# EasyEDA Pro project ProPrj_机房综合监控系统设计与实现_2026-04-17.epro

# Schematic Schematic1
Assembly Variant: Basic; Board Name: Board1; Create Date: 2026-04-17; Page Name: P1; Project Name: 机房综合监控系统设计与实现; Schematic Name: Schematic1; Update Date: 2026-04-17; BladeWidth: 10; Company: 嘉立创EDA; Page Size: A4; RegionStart: 1; ShowBorder: 1; TitleBlock: 1; TitleBlockPosition: 3; Version: V1.0; XRegionCount: 6; YRegionCount: 4
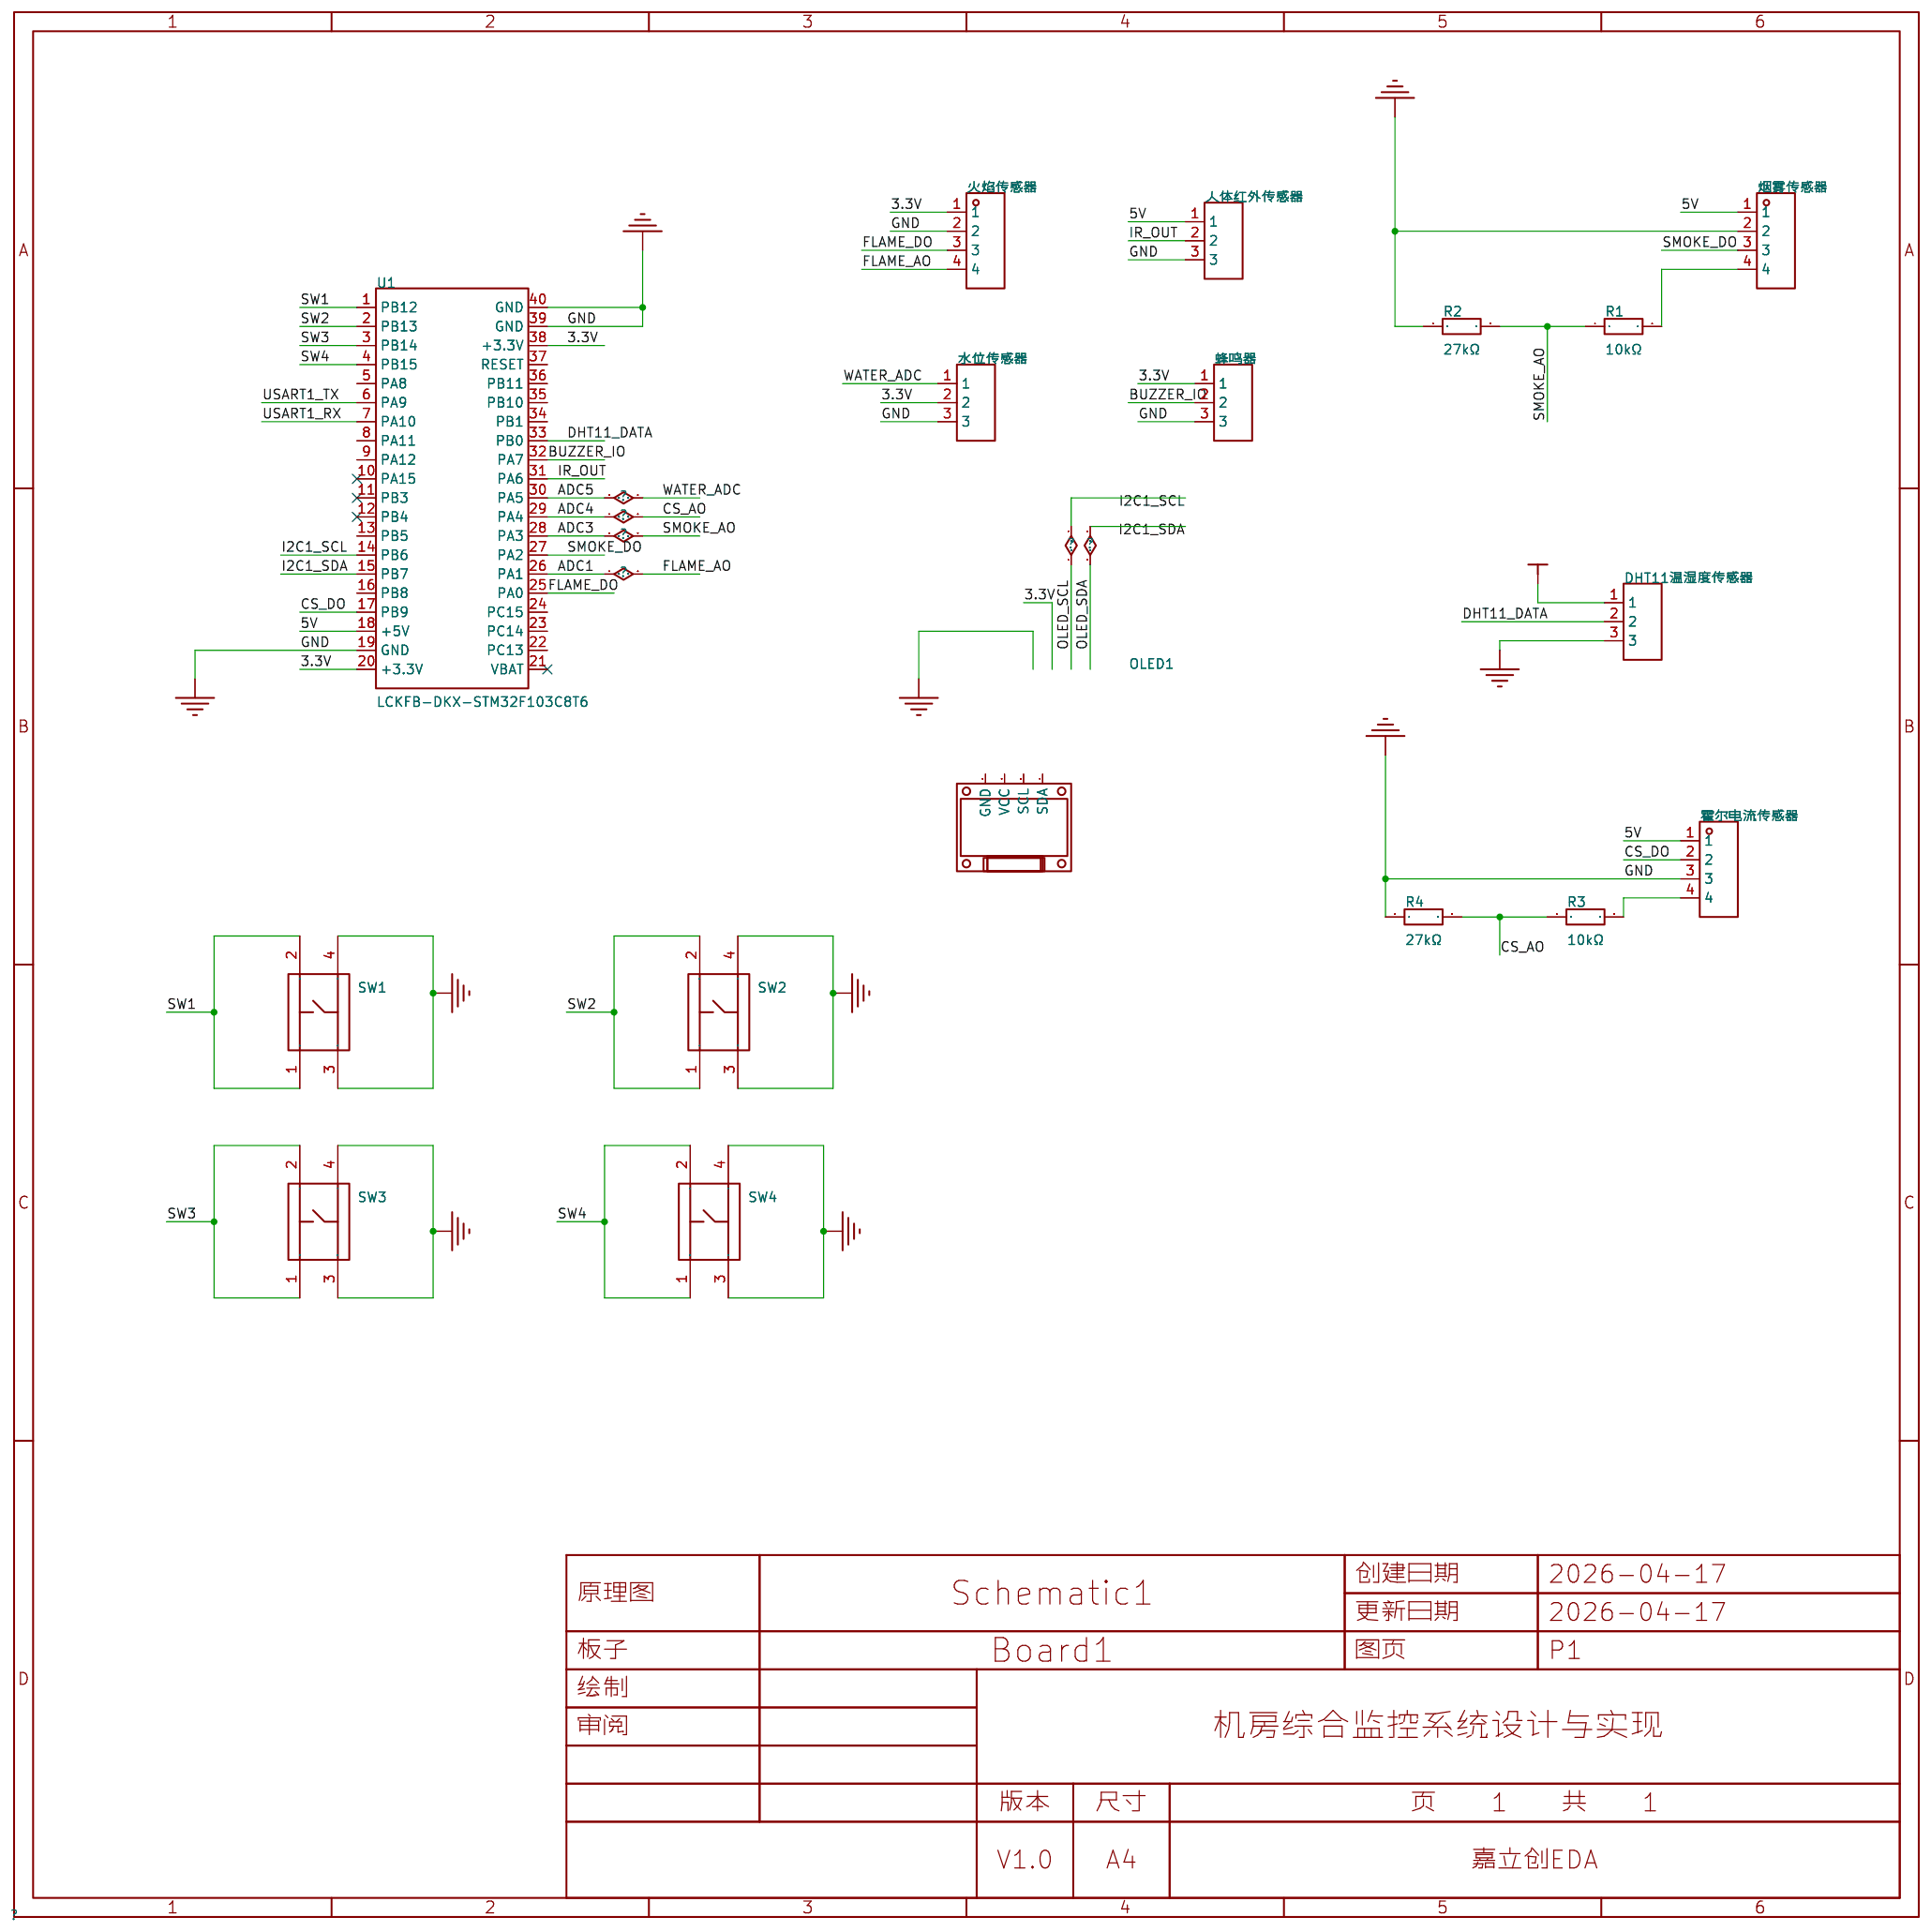
[diagram p0: schematic sheet]

## Parts
DHT11温湿度传感器  -  [HDR-TH_3P-P2.54-V-F]
OLED1  -  [0.96OLED_4P]
R1  10kΩ  [R0805]
R2  27kΩ  [R0805]
R3  10kΩ  [R0805]
R4  27kΩ  [R0805]
SW1  K2-1102DP-C4SW-04  [KEY-TH_4P-L6.0-W6.0-P4.50-LS6.50]
SW2  K2-1102DP-C4SW-04  [KEY-TH_4P-L6.0-W6.0-P4.50-LS6.50]
SW3  K2-1102DP-C4SW-04  [KEY-TH_4P-L6.0-W6.0-P4.50-LS6.50]
SW4  K2-1102DP-C4SW-04  [KEY-TH_4P-L6.0-W6.0-P4.50-LS6.50]
U1  LCKFB-DKX-STM32F103C8T6  [CONN-TH_L53.3-W22.9_STM32F103C8T6-CARD]
人体红外传感器  -  [HDR-TH_3P-P2.54-V-F]
水位传感器  -  [HDR-TH_3P-P2.54-V-F]
火焰传感器  -  [HDR-TH_4P-P2.54-V-F]
烟雾传感器  -  [HDR-TH_4P-P2.54-V-F]
蜂鸣器  -  [HDR-TH_3P-P2.54-V-F]
霍尔电流传感器  -  [HDR-TH_4P-P2.54-V-F]

## Library data of the parts
DHT11温湿度传感器 人体红外传感器 水位传感器 蜂鸣器 = HDR-F_2.54_1x3P: Supplier Part: C541850; Supplier Footprint: 插件
OLED1 = 0.96OLED模块_4P: Supplier Footprint: 插件
R1-R4 = 0805W8F1002T5E_C17414: 电阻类型:厚膜电阻;阻值:10kΩ;精度:±1%;功率:125mW;工作电压:150V;温度系数:±100ppm/℃;; LCSC Part Name: 10kΩ ±1% 125mW 厚膜电阻; Supplier Part: C17414; Manufacturer: UNI-ROYAL(厚声); Manufacturer Part: 0805W8F1002T5E; Supplier Footprint: 0805; JLCPCB Part Class: Basic Part; Datasheet: https://item.szlcsc.com/datasheet/0805W8F1002T5E/18102.html; Supplier: LCSC; Type: 厚膜电阻; Tolerance: ±1%; Power(Watts): 125mW; Voltage-Supply(Max): 150V; Temperature Coefficient: ±100ppm/℃; Operating Temperature: -55℃~+155℃
SW1-SW4 = K2-1102DP-C4SW-04: 电路结构:单刀单掷;按钮形状:圆形按钮;作用力:2.5N;安装方式:直插;开关长度:6mm;开关宽度:6mm;开关高度:5mm;触点电流:50mA;额定电压:12V;带灯:-;工作寿命:10万次;; LCSC Part Name: 轻触按键开关6*6*5; Supplier Part: C110153; Manufacturer: 韩国韩荣; Supplier Footprint: 插件-4P,6x6mm; JLCPCB Part Class: Extended Part; Datasheet: https://item.szlcsc.com/datasheet/K2-1102DP-C4SW-04/111374.html; Supplier: LCSC; Circuit: 单刀单掷; Actuator Style: 圆形按钮; Operating Force: 2.5N; Mounting Type: 直插; Length: 6mm; Width: 6mm; Switch Height: 5mm; Contact Current: 50mA; Voltage Rating: 12V; Life: 10万次; Operating Temperature: -25℃~+85℃
U1 = LCKFB-DKX-STM32F103C8T6: 搭载Contex M3内核,程序存储容量64KB,RAM总容量20KB,最高72MHz主频,提供高效的计算能力和稳定的运行环境。; LCSC Part Name: 立创·地阔星-STM32F103C8T6开发板; Supplier Part: C22396880; Manufacturer: 立创开发板; JLCPCB Part Class: Extended Part; Datasheet: https://item.szlcsc.com/datasheet/LCKFB-DKX-STM32F103C8T6/24005615.html; Supplier: LCSC
火焰传感器 烟雾传感器 霍尔电流传感器 = HDR-F_2.54_1x4P: Supplier Part: C2718488; Supplier Footprint: 插件

## Nets
3.3V: DHT11温湿度传感器.1 U1.20(+3.3V) U1.38(+3.3V) 水位传感器.2 火焰传感器.1 蜂鸣器.1
5V: U1.18(+5V) 人体红外传感器.1 烟雾传感器.1 霍尔电流传感器.1
GND: DHT11温湿度传感器.3 R2.1 R4.1 SW1.3 SW1.4 SW2.3 SW2.4 SW3.3 SW3.4 SW4.3 SW4.4 U1.19(GND) U1.39(GND) U1.40(GND) 人体红外传感器.3 水位传感器.3 火焰传感器.2 烟雾传感器.2 蜂鸣器.3 霍尔电流传感器.3
ADC1: U1.26(PA1) 火焰传感器.4
ADC3: R1.1 R2.2 U1.28(PA3)
ADC4: R3.1 R4.2 U1.29(PA4)
ADC5: U1.30(PA5) 水位传感器.1
BUZZER_IO: U1.32(PA7) 蜂鸣器.2
CS_DO: U1.17(PB9) 霍尔电流传感器.2
DHT11_DATA: DHT11温湿度传感器.2 U1.33(PB0)
FLAME_DO: U1.25(PA0) 火焰传感器.3
I2C1_SCL: U1.14(PB6)
I2C1_SDA: U1.15(PB7)
IR_OUT: U1.31(PA6) 人体红外传感器.2
SMOKE_DO: U1.27(PA2) 烟雾传感器.3
SW1: SW1.1 SW1.2 U1.1(PB12)
SW2: SW2.1 SW2.2 U1.2(PB13)
SW3: SW3.1 SW3.2 U1.3(PB14)
SW4: SW4.1 SW4.2 U1.4(PB15)
USART1_RX: U1.7(PA10)
USART1_TX: U1.6(PA9)
$1N28: R1.2 烟雾传感器.4
$1N67: R3.2 霍尔电流传感器.4

Not connected (* = marked no-connect by the designer): OLED1 1(GND) 2(VCC) 3(SCL) 4(SDA); U1 5(PA8) 8(PA11) 9(PA12) 10(PA15)* 11(PB3)* 12(PB4)* 13(PB5) 16(PB8) 21(VBAT)* 22(PC13) 23(PC14) 24(PC15) 34(PB1) 35(PB10) 36(PB11) 37(RESET)

# Board PCB1
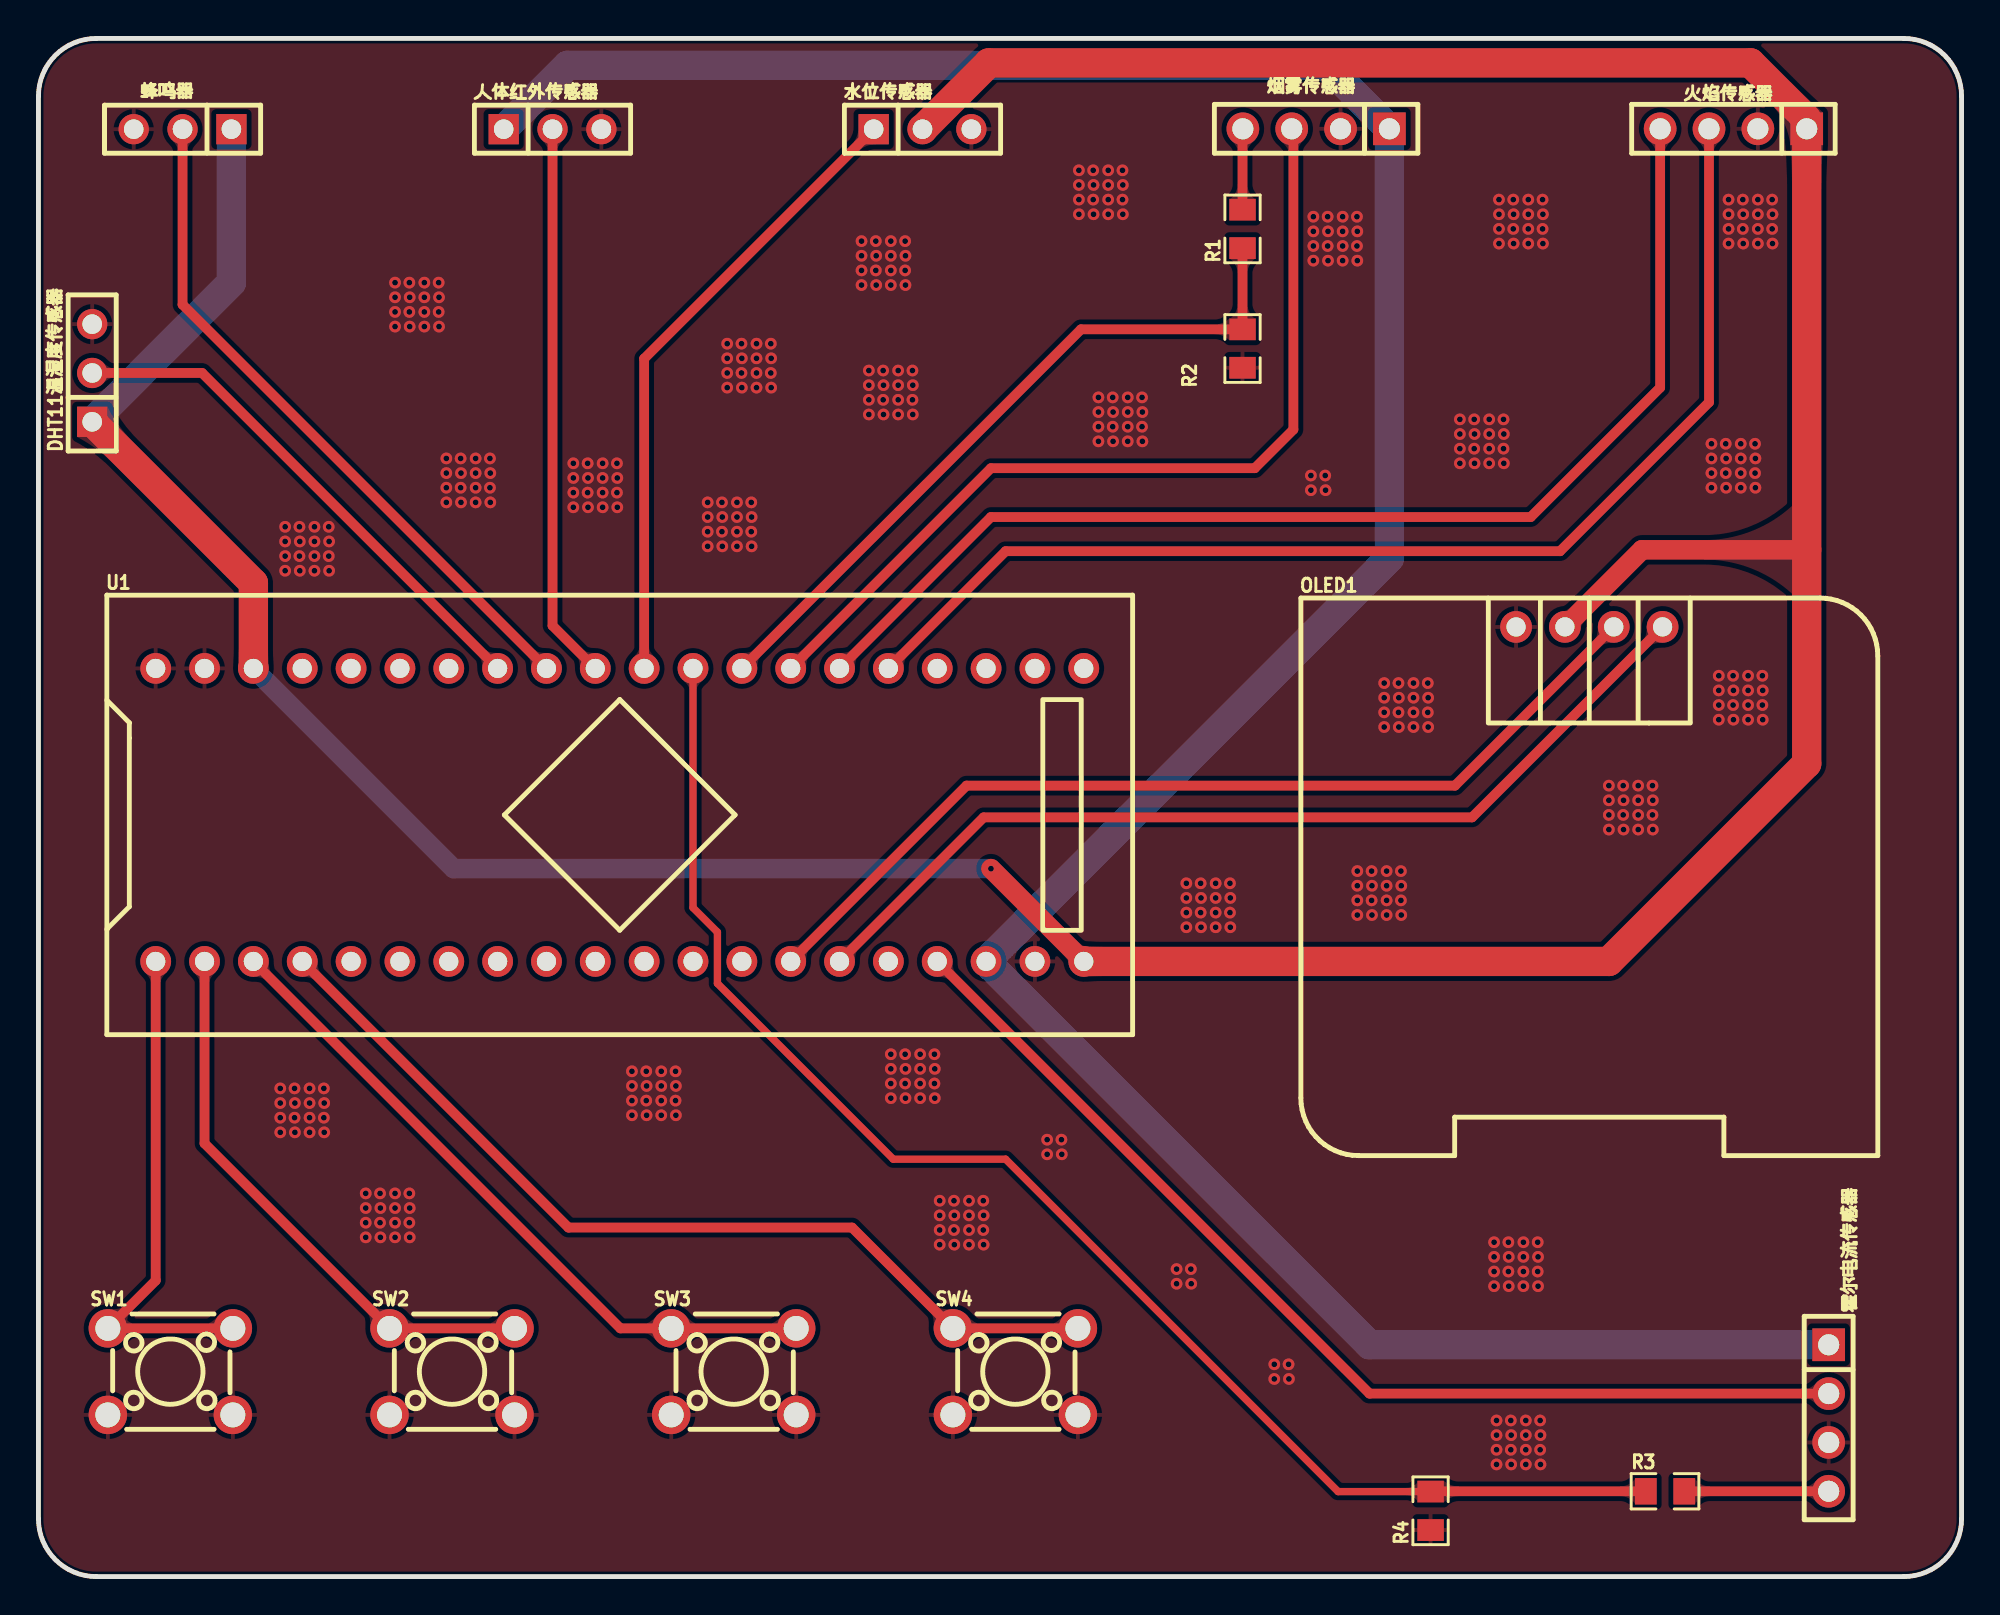
[diagram p1: board, top side]
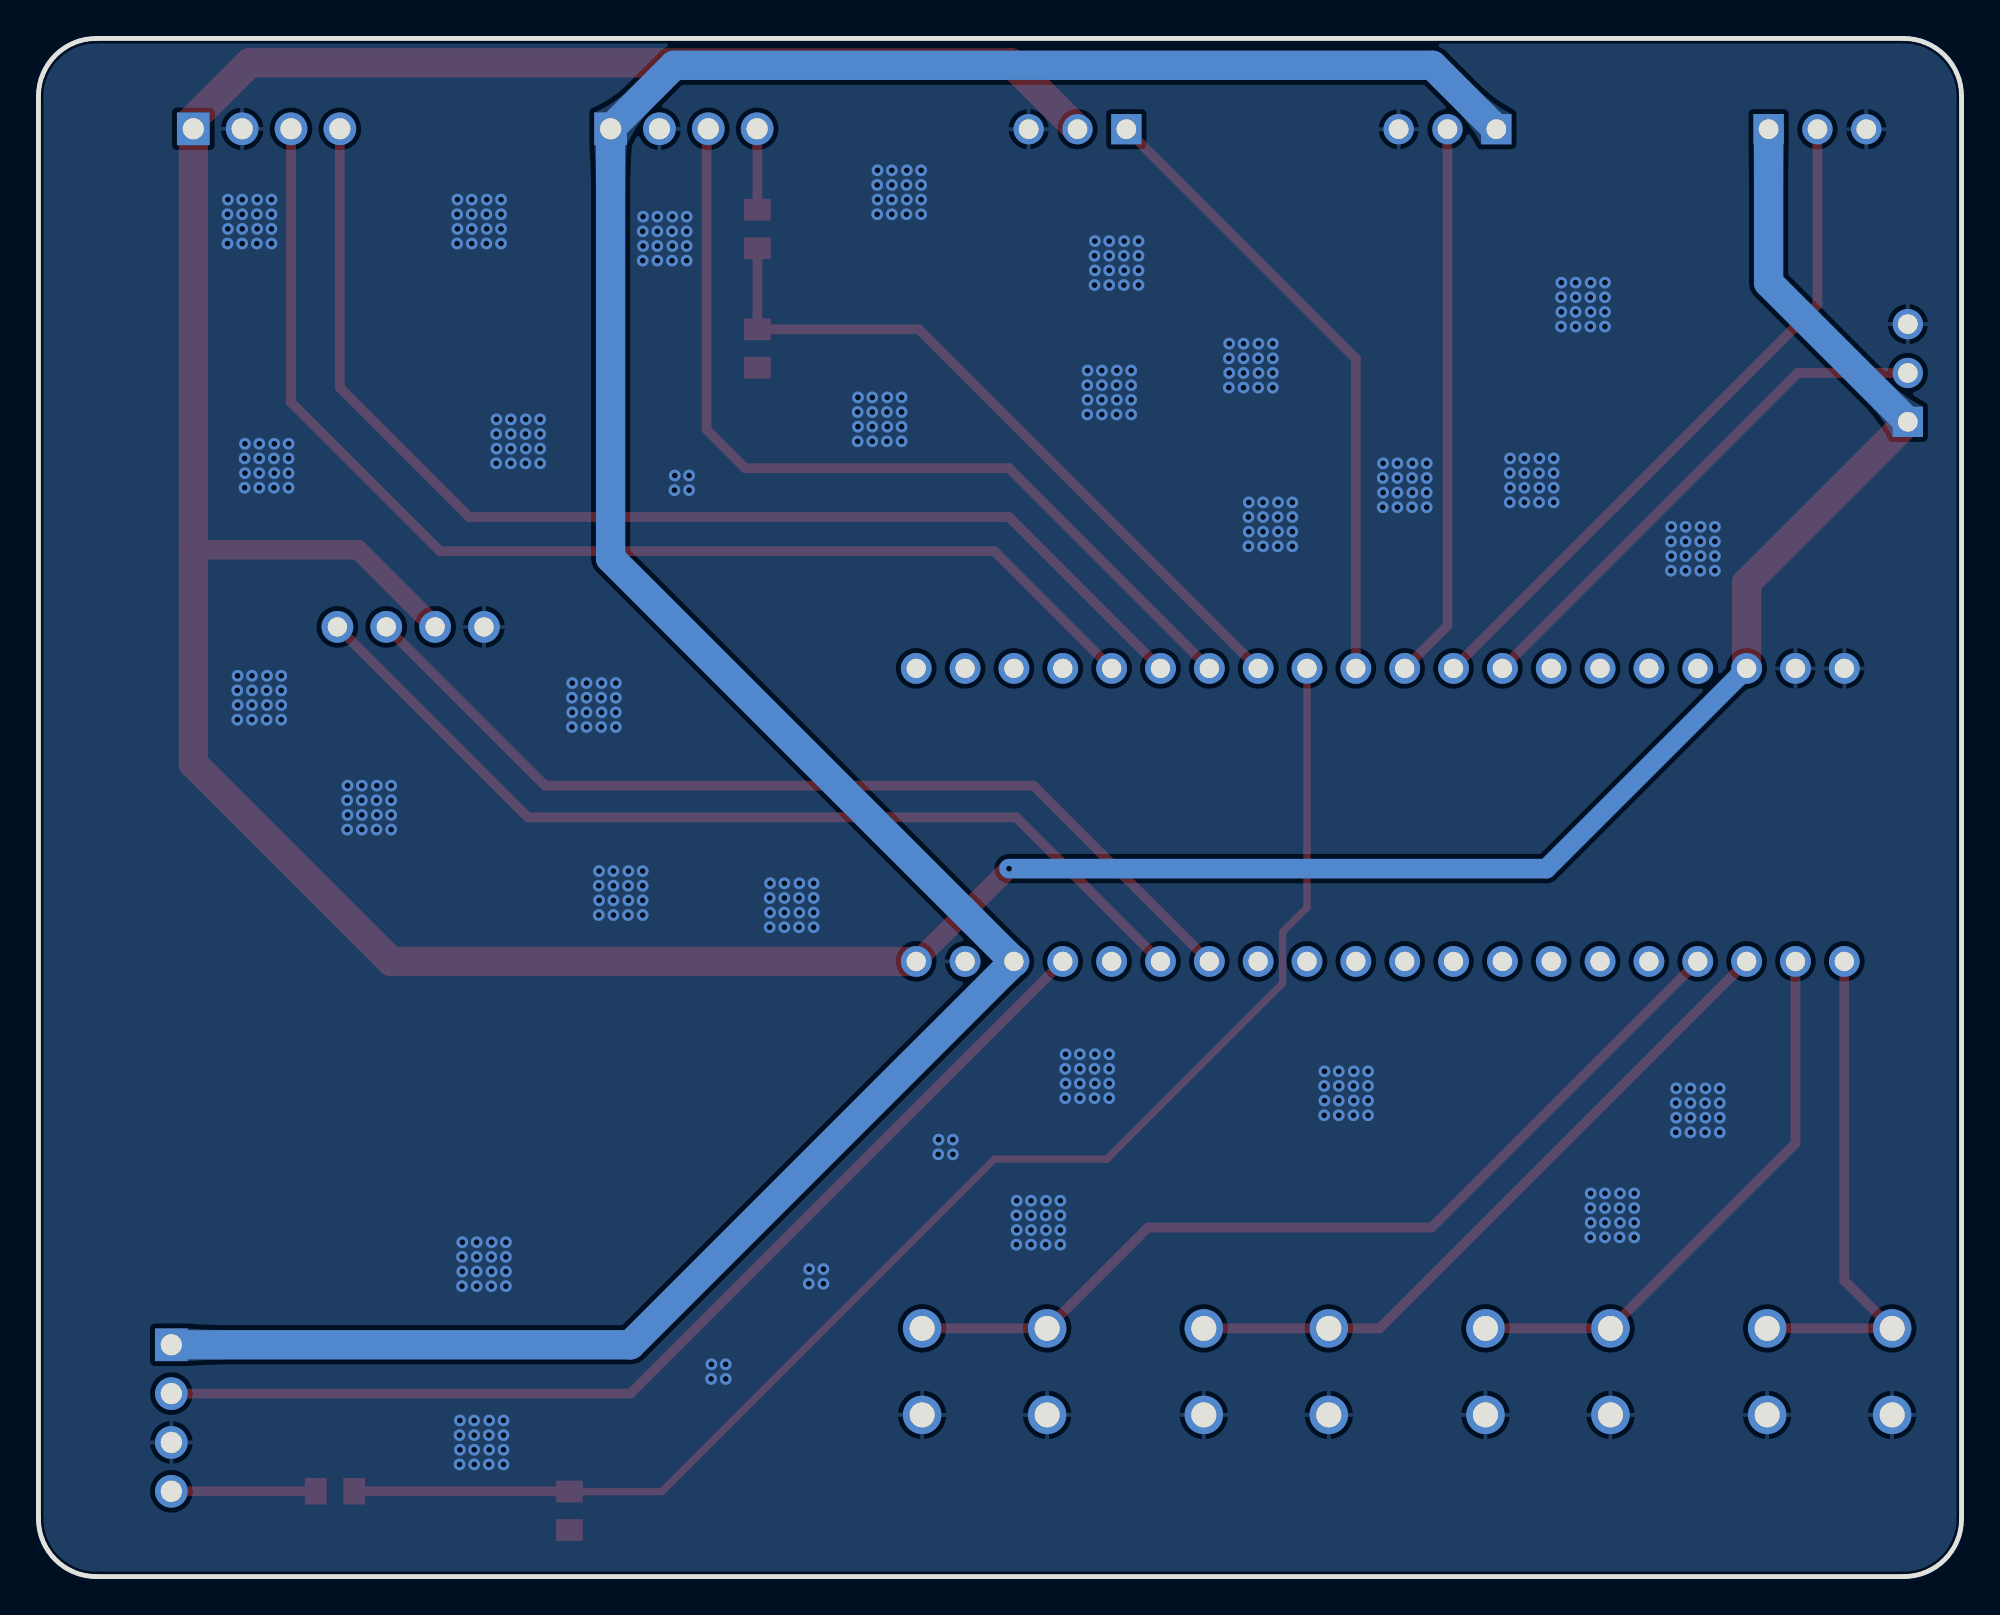
[diagram p2: board, bottom side, seen from below]

Outline 100 x 80 mm; copper layers: Top Layer, Bottom Layer. Coordinates in mm from the lower left corner of the outline.
Outline path: 0,77 0,3 arc(0.88,0.88) 3,0 97,0 arc(99.12,0.88) 100,3 100,77 arc(99.12,79.12) 97,80 3,80 arc(0.88,79.12) 0,77
Stack: Top Layer 0.035mm / Dielectric1 1.51mm FR4 er 4.5 / Bottom Layer 0.035mm

## Design rules (mm)
spacing copperThickness1oz (default): track to track 0.102, other pairs 0.152 to 0.3
spacing copperThickness2oz: track to track 0.203, other pairs 0.152 to 0.3
track width copperThickness1oz (default): min 0.127, default 0.254, max 2.54
track width copperThickness2oz: min 0.203, default 0.254, max 2.54
differential pair differentialPair (default): width min 0.127, default 0.254, max 2.54; gap min 0.152, default 0.152
net GND uses copperRegion

## Placement (name value [footprint] x y rotation side)
DHT11温湿度传感器  -  [HDR-TH_3P-P2.54-V-F]  2.79 62.6 90 top
OLED1  -  [0.96OLED_4P]  80.65 49.39 0 top
R1  10kΩ  [R0805]  62.61 70.09 90 top
R2  27kΩ  [R0805]  62.61 63.87 90 top
R3  10kΩ  [R0805]  84.58 4.44 0 top
R4  27kΩ  [R0805]  72.39 3.42 90 top
SW1  K2-1102DP-C4SW-04  [KEY-TH_4P-L6.0-W6.0-P4.50-LS6.50]  6.86 10.66 0 top
SW2  K2-1102DP-C4SW-04  [KEY-TH_4P-L6.0-W6.0-P4.50-LS6.50]  21.51 10.66 0 top
SW3  K2-1102DP-C4SW-04  [KEY-TH_4P-L6.0-W6.0-P4.50-LS6.50]  36.15 10.66 0 top
SW4  K2-1102DP-C4SW-04  [KEY-TH_4P-L6.0-W6.0-P4.50-LS6.50]  50.8 10.66 0 top
U1  LCKFB-DKX-STM32F103C8T6  [CONN-TH_L53.3-W22.9_STM32F103C8T6-CARD]  30.23 39.61 0 top
人体红外传感器  -  [HDR-TH_3P-P2.54-V-F]  26.73 75.28 0 top
水位传感器  -  [HDR-TH_3P-P2.54-V-F]  45.97 75.28 0 top
火焰传感器  -  [HDR-TH_4P-P2.54-V-F]  88.14 75.3 180 top
烟雾传感器  -  [HDR-TH_4P-P2.54-V-F]  66.44 75.3 180 top
蜂鸣器  -  [HDR-TH_3P-P2.54-V-F]  7.49 75.28 180 top
霍尔电流传感器  -  [HDR-TH_4P-P2.54-V-F]  93.09 8.25 270 top

## Footprints (pads in the part's own frame, mm; a bottom-side part is the same pattern mirrored in y, then rotated)
0.96OLED_4P
  round 1.65 hole 1: 1(-3.81,-0.002) 2(-1.27,0.002) 3(1.27,0.002) 4(3.81,0.002)
CONN-TH_L53.3-W22.9_STM32F103C8T6-CARD
  round 1.6 hole 1: 1(-24.13,-7.62) 2(-21.59,-7.62) 3(-19.05,-7.62) 4(-16.51,-7.62) 5(-13.97,-7.62) 6(-11.43,-7.62) 7(-8.89,-7.62) 8(-6.35,-7.62) 9(-3.81,-7.62) 10(-1.27,-7.62) 11(1.27,-7.62) 12(3.81,-7.62) 13(6.35,-7.62) 14(8.89,-7.62) 15(11.43,-7.62) 16(13.97,-7.62) 17(16.51,-7.62) 18(19.05,-7.62) 19(21.59,-7.62) 20(24.13,-7.62) 21(24.13,7.62) 22(21.59,7.62) 23(19.05,7.62) 24(16.51,7.62) 25(13.97,7.62) 26(11.43,7.62) 27(8.89,7.62) 28(6.35,7.62) 29(3.81,7.62) 30(1.27,7.62) 31(-1.27,7.62) 32(-3.81,7.62) 33(-6.35,7.62) 34(-8.89,7.62) 35(-11.43,7.62) 36(-13.97,7.62) 37(-16.51,7.62) 38(-19.05,7.62) 39(-21.59,7.62) 40(-24.13,7.62)
HDR-TH_3P-P2.54-V-F
  rect 1.575x1.575 hole 1.02: 1(-2.54,0)
  round 1.575 hole 1.02: 2(0,0) 3(2.54,0)
HDR-TH_4P-P2.54-V-F
  rect 1.7x1.7 hole 1.1: 1(-3.81,0)
  round 1.7 hole 1.1: 2(-1.27,0) 3(1.27,0) 4(3.81,0)
KEY-TH_4P-L6.0-W6.0-P4.50-LS6.50
  round 2 hole 1.3: 1(-3.25,2.25) 2(3.25,2.25) 3(-3.25,-2.25) 4(3.25,-2.25)
R0805
  rect 1.133x1.377 smd: 1(-1,0) 2(1,0)

## Nets
As in the schematic, except:
3.3V: DHT11温湿度传感器.1 OLED1.2 U1.20 U1.38 水位传感器.2 火焰传感器.1 蜂鸣器.1
GND: DHT11温湿度传感器.3 OLED1.1 R2.1 R4.1 SW1.3 SW1.4 SW2.3 SW2.4 SW3.3 SW3.4 SW4.3 SW4.4 U1.19 U1.39 U1.40 人体红外传感器.3 水位传感器.3 火焰传感器.2 烟雾传感器.2 蜂鸣器.3 霍尔电流传感器.3
I2C1_SCL: OLED1.3 U1.14
I2C1_SDA: OLED1.4 U1.15

Pads without a net: U1 5 8 9 10 11 12 13 16 21 22 23 24 34 35 36 37

## Via types
v1: diameter 0.61, hole 0.305, Top Layer to Bottom Layer, 449 vias

## Routing (per net, layer and track width the routed paths; a pad name or vN(x,y) marks a point on that pad's centre or on a via; arc(x,y) is an arc through that point)
3.3V: length 222.2
  Top Layer w1.016: v1(49.53,36.82) U1.20 ; OLED1.2 83.38,53.4 91.95,53.4
  Top Layer w1.524: 水位传感器.2 49.42,78.73 89.03,78.73 91.95,75.81 火焰传感器.1 91.95,42.28 81.66,31.99 U1.20 ; U1.38 11.18,51.68 DHT11温湿度传感器.1
  Bottom Layer w1.016: v1(49.53,36.82) 21.59,36.82 U1.38
  Bottom Layer w1.524: 蜂鸣器.1 10.03,67.3 DHT11温湿度传感器.1
5V: length 152.9
  Bottom Layer w1.524: 霍尔电流传感器.1 69.22,12.06 U1.18 70.25,52.97 烟雾传感器.1 66.95,78.6 27.51,78.6 人体红外传感器.1
GND:
  vias: v1(12.57,25.39) v1(12.57,24.63) v1(12.57,23.87) v1(12.57,23.1) v1(12.83,54.6) v1(12.83,53.84) v1(12.83,53.08) v1(12.83,52.31) v1(13.32,25.39) v1(13.33,24.63) v1(13.32,23.87) v1(13.33,23.1) v1(13.57,54.6) v1(13.59,53.84) v1(13.57,53.08) v1(13.59,52.31) v1(14.1,25.39) v1(14.1,24.63) v1(14.1,23.87) v1(14.1,23.1) v1(14.35,54.6) v1(14.35,53.84) v1(14.35,53.08) v1(14.35,52.31) v1(14.84,25.39) v1(14.84,23.87) v1(14.86,24.63) v1(14.86,23.1) v1(15.09,54.6) v1(15.11,53.84) v1(15.09,53.08) v1(15.11,52.31) v1(17.02,19.93) v1(17.02,19.17) v1(17.02,18.41) v1(17.02,17.64) v1(17.76,19.93) v1(17.78,19.17) v1(17.76,18.41) v1(17.78,17.64) v1(18.54,67.3) v1(18.54,66.54) v1(18.54,65.78) v1(18.54,65.01) v1(18.54,19.93) v1(18.54,19.17) v1(18.54,18.41) v1(18.54,17.64) v1(19.29,67.3) v1(19.3,66.54) v1(19.29,65.78) v1(19.3,65.01) v1(19.29,19.93) v1(19.3,19.17) v1(19.29,18.41) v1(19.3,17.64) v1(20.07,67.3) v1(20.07,66.54) v1(20.07,65.78) v1(20.07,65.01) v1(20.81,67.3) v1(20.83,66.54) v1(20.81,65.78) v1(20.83,65.01) v1(21.21,58.16) v1(21.21,57.39) v1(21.21,56.63) v1(21.21,55.87) v1(21.95,58.16) v1(21.97,57.39) v1(21.95,56.63) v1(21.97,55.87) v1(22.73,58.16) v1(22.73,57.39) v1(22.73,56.63) v1(22.73,55.87) v1(23.48,58.16) v1(23.5,57.39) v1(23.48,56.63) v1(23.5,55.87) v1(27.81,57.9) v1(27.81,57.14) v1(27.81,56.38) v1(27.81,55.62) v1(28.56,57.9) v1(28.57,57.14) v1(28.56,56.38) v1(28.57,55.62) v1(29.34,57.9) v1(29.34,57.14) v1(29.34,56.38) v1(29.34,55.62) v1(30.08,57.9) v1(30.1,57.14) v1(30.08,56.38) v1(30.1,55.62) v1(30.86,26.28) v1(30.86,25.52) v1(30.86,24.75) v1(30.86,23.99) v1(31.6,26.28) v1(31.62,25.52) v1(31.6,24.75) v1(31.62,23.99) v1(32.38,26.28) v1(32.38,25.52) v1(32.38,24.75) v1(32.38,23.99) v1(33.13,26.28) v1(33.15,25.52) v1(33.13,24.75) v1(33.15,23.99) v1(34.8,55.87) v1(34.8,55.11) v1(34.8,54.35) v1(34.8,53.58) v1(35.54,55.87) v1(35.54,54.35) v1(35.56,55.11) v1(35.56,53.58) v1(35.81,64.12) v1(35.81,63.36) v1(35.81,62.6) v1(35.81,61.84) v1(36.32,55.87) v1(36.32,55.11) v1(36.32,54.35) v1(36.32,53.58) v1(36.56,64.12) v1(36.58,63.36) v1(36.56,62.6) v1(36.58,61.84) v1(37.07,55.87) v1(37.08,55.11) v1(37.07,54.35) v1(37.08,53.58) v1(37.34,64.12) v1(37.34,63.36) v1(37.34,62.6) v1(37.34,61.84) v1(38.08,64.12) v1(38.1,63.36) v1(38.08,62.6) v1(38.1,61.84) v1(42.8,69.46) v1(42.8,68.7) v1(42.8,67.94) v1(42.8,67.17) v1(43.18,62.73) v1(43.18,61.97) v1(43.18,61.2) v1(43.18,60.44) v1(43.54,69.46) v1(43.54,67.94) v1(43.56,68.7) v1(43.56,67.17) v1(43.92,62.73) v1(43.94,61.97) v1(43.92,61.2) v1(43.94,60.44) v1(44.32,69.46) v1(44.32,68.7) v1(44.32,67.94) v1(44.32,67.17) v1(44.32,27.17) v1(44.32,26.41) v1(44.32,25.64) v1(44.32,24.88) v1(44.7,62.73) v1(44.7,61.97) v1(44.7,61.2) v1(44.7,60.44) v1(45.07,69.46) v1(45.09,68.7) v1(45.07,67.94) v1(45.09,67.17) v1(45.07,27.17) v1(45.09,26.41) v1(45.07,25.64) v1(45.09,24.88) v1(45.45,62.73) v1(45.45,61.2) v1(45.47,61.97) v1(45.47,60.44) v1(45.85,27.17) v1(45.85,26.41) v1(45.85,25.64) v1(45.85,24.88) v1(46.59,27.17) v1(46.61,26.41) v1(46.59,25.64) v1(46.61,24.88) v1(46.86,19.55) v1(46.86,18.79) v1(46.86,18.02) v1(46.86,17.26) v1(47.61,19.55) v1(47.62,18.79) v1(47.61,18.02) v1(47.62,17.26) v1(48.39,19.55) v1(48.39,18.79) v1(48.39,18.02) v1(48.39,17.26) v1(49.13,19.55) v1(49.15,18.79) v1(49.13,18.02) v1(49.15,17.26) v1(52.45,22.72) v1(52.45,21.96) v1(53.19,22.72) v1(53.21,21.96) v1(54.1,73.14) v1(54.1,72.38) v1(54.1,71.62) v1(54.1,70.86) v1(54.85,73.14) v1(54.85,71.62) v1(54.86,72.38) v1(54.86,70.86) v1(55.12,61.33) v1(55.12,60.57) v1(55.12,59.81) v1(55.12,59.05) v1(55.63,73.14) v1(55.63,72.38) v1(55.63,71.62) v1(55.63,70.86) v1(55.86,61.33) v1(55.88,60.57) v1(55.86,59.81) v1(55.88,59.05) v1(56.37,73.14) v1(56.39,72.38) v1(56.37,71.62) v1(56.39,70.86) v1(56.64,61.33) v1(56.64,60.57) v1(56.64,59.81) v1(56.64,59.05) v1(57.39,61.33) v1(57.4,60.57) v1(57.39,59.81) v1(57.4,59.05) v1(59.18,15.99) v1(59.18,15.23) v1(59.69,36.06) v1(59.69,35.3) v1(59.69,34.53) v1(59.69,33.77) v1(59.93,15.99) v1(59.94,15.23) v1(60.43,36.06) v1(60.43,34.53) v1(60.45,35.3) v1(60.45,33.77) v1(61.21,36.06) v1(61.21,35.3) v1(61.21,34.53) v1(61.21,33.77) v1(61.96,36.06) v1(61.98,35.3) v1(61.96,34.53) v1(61.98,33.77) v1(64.26,11.04) v1(64.26,10.28) v1(65.01,11.04) v1(65.02,10.28) v1(66.17,57.27) v1(66.17,56.5) v1(66.29,70.73) v1(66.29,69.97) v1(66.29,69.2) v1(66.29,68.44) v1(66.91,57.27) v1(66.93,56.5) v1(67.04,70.73) v1(67.04,69.2) v1(67.06,69.97) v1(67.06,68.44) v1(67.82,70.73) v1(67.82,69.97) v1(67.82,69.2) v1(67.82,68.44) v1(68.56,70.73) v1(68.58,69.97) v1(68.56,69.2) v1(68.58,68.44) v1(68.58,36.69) v1(68.58,35.93) v1(68.58,35.17) v1(68.58,34.41) v1(69.32,36.69) v1(69.34,35.93) v1(69.32,35.17) v1(69.34,34.41) v1(69.98,46.47) v1(69.98,45.71) v1(69.98,44.95) v1(69.98,44.19) v1(70.1,36.69) v1(70.1,35.93) v1(70.1,35.17) v1(70.1,34.41) v1(70.72,46.47) v1(70.74,45.71) v1(70.72,44.95) v1(70.74,44.19) v1(70.85,36.69) v1(70.85,35.17) v1(70.87,35.93) v1(70.87,34.41) v1(71.5,46.47) v1(71.5,45.71) v1(71.5,44.95) v1(71.5,44.19) v1(72.24,46.47) v1(72.24,44.95) v1(72.26,45.71) v1(72.26,44.19) v1(73.91,60.19) v1(73.91,59.43) v1(73.91,58.66) v1(73.91,57.9) v1(74.66,60.19) v1(74.68,59.43) v1(74.66,58.66) v1(74.68,57.9) v1(75.44,60.19) v1(75.44,59.43) v1(75.44,58.66) v1(75.44,57.9) v1(75.69,17.39) v1(75.69,16.63) v1(75.69,15.87) v1(75.69,15.1) v1(75.82,8.12) v1(75.82,7.36) v1(75.82,6.59) v1(75.82,5.83) v1(75.95,71.62) v1(75.95,70.86) v1(75.95,70.09) v1(75.95,69.33) v1(76.18,60.19) v1(76.2,59.43) v1(76.18,58.66) v1(76.2,57.9) v1(76.44,17.39) v1(76.44,15.87) v1(76.45,16.63) v1(76.45,15.1) v1(76.56,8.12) v1(76.58,7.36) v1(76.56,6.59) v1(76.58,5.83) v1(76.69,71.62) v1(76.71,70.86) v1(76.69,70.09) v1(76.71,69.33) v1(77.22,17.39) v1(77.22,16.63) v1(77.22,15.87) v1(77.22,15.1) v1(77.34,8.12) v1(77.34,7.36) v1(77.34,6.59) v1(77.34,5.83) v1(77.47,71.62) v1(77.47,70.86) v1(77.47,70.09) v1(77.47,69.33) v1(77.96,17.39) v1(77.98,16.63) v1(77.96,15.87) v1(77.98,15.1) v1(78.09,8.12) v1(78.1,7.36) v1(78.09,6.59) v1(78.1,5.83) v1(78.21,71.62) v1(78.23,70.86) v1(78.21,70.09) v1(78.23,69.33) v1(81.66,41.14) v1(81.66,40.38) v1(81.66,39.61) v1(81.66,38.85) v1(82.4,41.14) v1(82.42,40.38) v1(82.4,39.61) v1(82.42,38.85) v1(83.19,41.14) v1(83.19,40.38) v1(83.19,39.61) v1(83.19,38.85) v1(83.93,41.14) v1(83.95,40.38) v1(83.93,39.61) v1(83.95,38.85) v1(87,58.92) v1(87,58.16) v1(87,57.39) v1(87,56.63) v1(87.38,46.85) v1(87.38,46.09) v1(87.38,45.33) v1(87.38,44.57) v1(87.74,58.92) v1(87.74,57.39) v1(87.76,58.16) v1(87.76,56.63) v1(87.88,71.62) v1(87.88,70.86) v1(87.88,70.09) v1(87.88,69.33) v1(88.12,46.85) v1(88.14,46.09) v1(88.12,45.33) v1(88.14,44.57) v1(88.52,58.92) v1(88.52,58.16) v1(88.52,57.39) v1(88.52,56.63) v1(88.63,71.62) v1(88.65,70.86) v1(88.63,70.09) v1(88.65,69.33) v1(88.9,46.85) v1(88.9,46.09) v1(88.9,45.33) v1(88.9,44.57) v1(89.26,58.92) v1(89.28,58.16) v1(89.26,57.39) v1(89.28,56.63) v1(89.41,71.62) v1(89.41,70.86) v1(89.41,70.09) v1(89.41,69.33) v1(89.64,46.85) v1(89.64,45.33) v1(89.66,46.09) v1(89.66,44.57) v1(90.15,71.62) v1(90.17,70.86) v1(90.15,70.09) v1(90.17,69.33)
ADC1: length 62.2
  Top Layer w0.508: 火焰传感器.4 84.33,61.84 77.6,55.11 49.53,55.11 U1.26
ADC3: length 37.6
  Top Layer w0.508: R1.1 R2.2 54.21,64.87 U1.28
ADC4: length 76.1
  Top Layer w0.381: U1.29 34.04,34.79 35.31,33.52 35.31,30.85 44.45,21.71 50.29,21.71 67.58,4.42 R4.2
  Top Layer w0.508: R4.2 72.41,4.44 R3.1
ADC5: length 33
  Top Layer w0.508: 水位传感器.1 31.5,63.35 U1.30
BUZZER_IO: length 35.9
  Top Layer w0.508: U1.32 7.49,66.16 蜂鸣器.2
CS_DO: length 55.7
  Top Layer w0.508: 霍尔电流传感器.2 69.22,9.51 U1.17
DHT11_DATA: length 27.4
  Top Layer w0.508: DHT11温湿度传感器.2 8.51,62.6 U1.33
FLAME_DO: length 62.6
  Top Layer w0.508: 火焰传感器.3 86.87,61.08 79.12,53.33 50.29,53.33 U1.25
I2C1_SCL: length 50
  Top Layer w0.508: U1.14 48.26,41.14 73.66,41.14 OLED1.3
I2C1_SDA: length 50
  Top Layer w0.508: U1.15 49.15,39.49 74.55,39.49 OLED1.4
IR_OUT: length 29
  Top Layer w0.508: U1.31 26.73,49.46 人体红外传感器.2
SMOKE_DO: length 47
  Top Layer w0.508: U1.27 49.53,57.65 63.25,57.65 65.26,59.66 65.26,75.21 烟雾传感器.3
SW1: length 26.6
  Top Layer w0.508: U1.1 6.1,15.4 SW1.1 SW1.2
SW2: length 29.6
  Top Layer w0.508: SW2.2 SW2.1 8.64,22.53 U1.2
SW3: length 36.1
  Top Layer w0.508: U1.3 30.26,12.91 SW3.1 SW3.2
SW4: length 48.2
  Top Layer w0.508: SW4.2 SW4.1 42.31,18.15 27.56,18.15 U1.4
$1N28: length 4.2
  Top Layer w0.508: 烟雾传感器.4 62.61,75.28 R1.2
$1N67: length 7.5
  Top Layer w0.508: R3.2 霍尔电流传感器.4

## Copper pours and planes (outline as drawn; the poured copper is in the pictures)
GND on Top Layer: -11.56,88 137.03,88 137.03,-9.79 -11.56,-9.79
GND on Bottom Layer: -9.53,89.02 148.97,89.02 148.97,-23.76 -9.53,-23.76

Small or netless copper shapes (teardrops, artwork), in the pictures only: 57 on Top Layer, 9 on Bottom Layer
